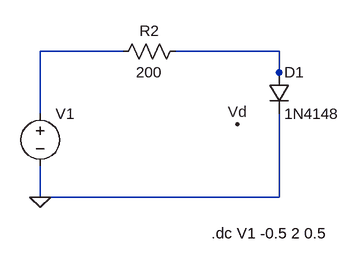
[diagram p0: schematic exp9_1-3.asc]
exp9_1-3.asc, the LTspice schematic file:
Version 4
SHEET 1 880 680
WIRE 80 160 -48 160
WIRE 320 160 160 160
WIRE 320 192 320 160
WIRE 320 208 320 192
WIRE -48 256 -48 160
WIRE -48 384 -48 336
WIRE 320 384 320 256
WIRE 320 384 -48 384
FLAG -48 384 0
FLAG 256 272 Vd
SYMBOL voltage -48 240 R0
SYMATTR InstName V1
SYMATTR Value ""
SYMBOL Res 176 144 R90
WINDOW 0 0 56 VBottom 2
WINDOW 3 32 56 VTop 2
SYMATTR InstName R2
SYMATTR Value 200
SYMBOL diode 304 192 R0
SYMATTR InstName D1
SYMATTR Value 1N4148
TEXT 216 440 Left 2 !.dc V1 -0.5 2 0.5

The netlist it stands for:
* exp9_1-3.asc
V1 N001 0
R2 N002 N001 200
D1 N002 0 1N4148
.model D D
.lib standard.dio
.dc V1 -0.5 2 0.5
.backanno
.end